# Altium schematic sheet ESP32-TEC.SchDoc
size A3
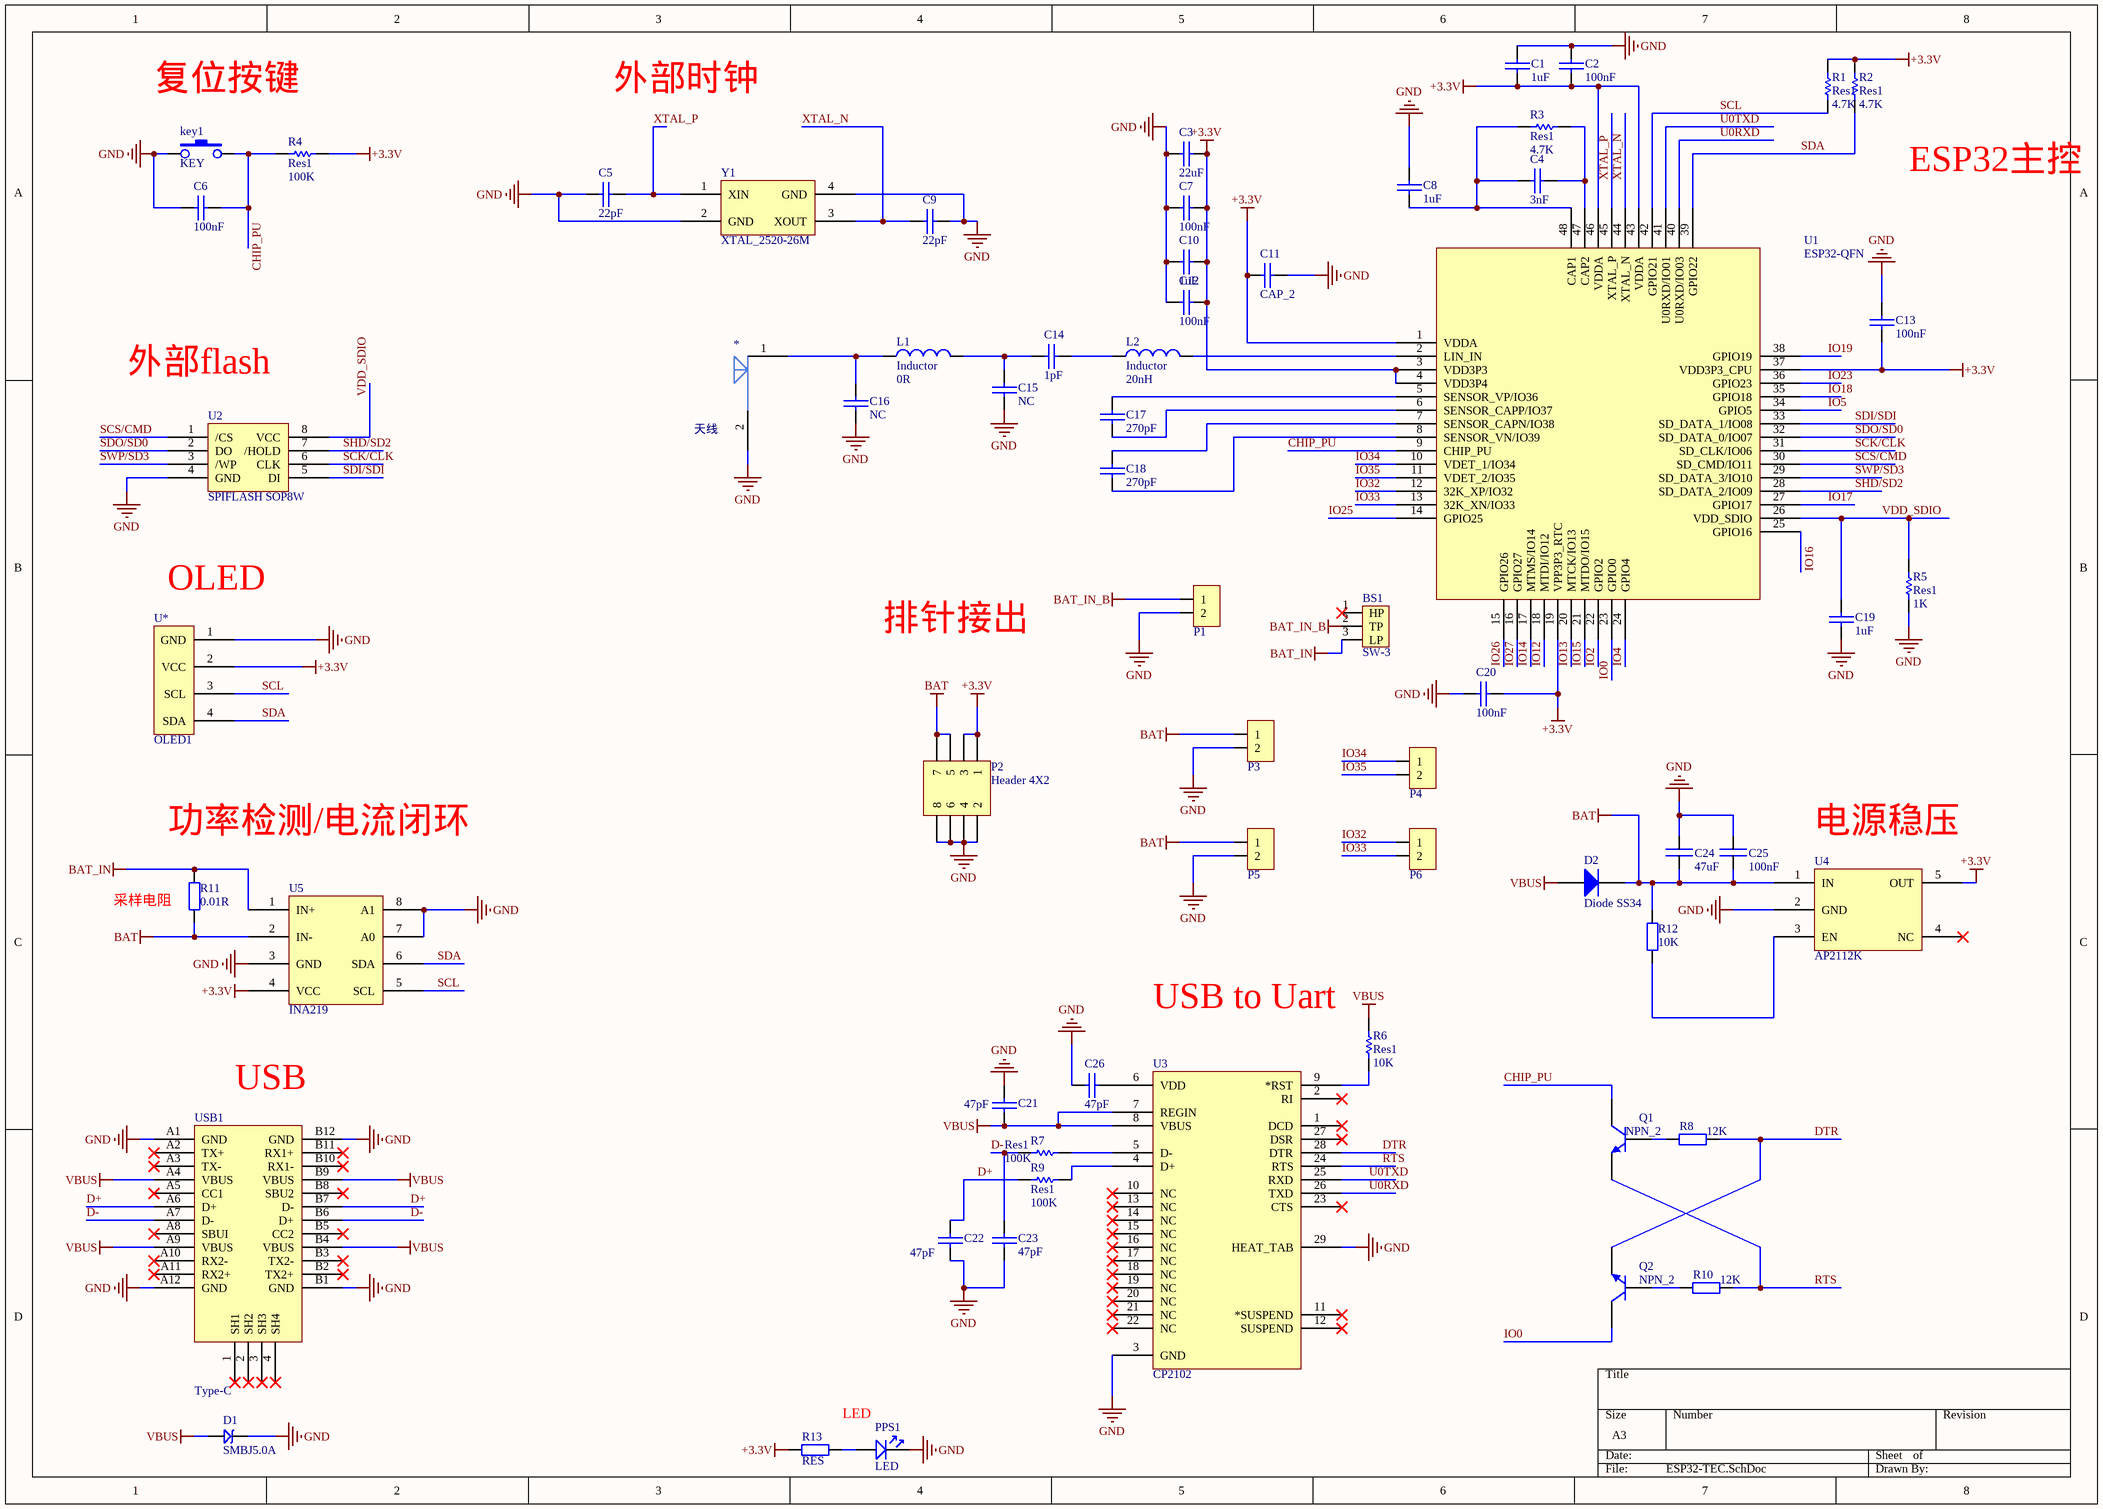
[diagram p0: ESP32-TEC.SchDoc]

## Parts
*  天线  [WIFI-ANT]
BS1  SW-3  [纽子开关]
C1  1uF  [0603-C]
C2  100nF  [0603-C]
C3  22uF  [0603-C]
C4  3nF  [0603-C]
C5  22pF  [0603-C]
C6  100nF  [0603-C]
C7  100nF  [0603-C]
C8  1uF  [0603-C]
C9  22pF  [0603-C]
C10  1uF  [0603-C]
C11  CAP_2  [0603-C]
C12  100nF  [0603-C]
C13  100nF  [0603-C]
C14  1pF  [0603-C]
C15  NC  [0603-C]
C16  NC  [0603-C]
C17  270pF  [0603-C]
C18  270pF  [0603-C]
C19  1uF  [0603-C]
C20  100nF  [0603-C]
C21  47pF  [0603-C]
C22  47pF  [0603-C]
C23  47pF  [0603-C]
C24  47uF  [0603-C]
C25  100nF  [0603-C]
C26  47pF  [0603-C]
D1  SMBJ5.0A  [0603-C]
D2  Diode SS34  [DIODE-SMA]
key1  KEY  [侧帖按键]
L1  Inductor  value 0R  [0603AR]
L2  Inductor  value 20nH  [0805_L]
P1  HDR1X2_180_2.54  [XT-30]  (value not drawn)
P2  Header 4X2  [HDR2X4]
P3  HDR1X2_180_2.54  [XT-30]  (value not drawn)
P4  HDR1X2_180_2.54  [XT-30]  (value not drawn)
P5  HDR1X2_180_2.54  [XT-30]  (value not drawn)
P6  HDR1X2_180_2.54  [XT-30]  (value not drawn)
PPS1  LED  [0603-C]
Q1  NPN_2  [SOT-23R - duplicate2]
Q2  NPN_2  [SOT-23R - duplicate2]
R1  Res1  value 4.7K  [0603-R]
R2  Res1  value 4.7K  [0603-R]
R3  Res1  value 4.7K  [0603-R]
R4  Res1  value 100K  [0603-R]
R5  Res1  value 1K  [0603-R]
R6  Res1  value 10K  [0603-R]
R7  Res1  value 100K  [0603-R]
R8  12K  [0603-R]
R9  Res1  value 100K  [0603-R]
R10  12K  [0603-R]
R11  0.01R  [1206]
R12  10K  [0603-R]
R13  RES  [0603P]
U1  ESP32-QFN  [QFN48-6x6]
U2  SPIFLASH SOP8W  [SOP-8]
U3  CP2102  [QFN28]
U4  AP2112K  [LC-SOT-23-5]
U5  INA219  [LC-SOT-23-8]
U*  OLED1  [HDR1X4]
USB1  Type-C  [Type-c]
Y1  XTAL_2520-26M  [2520无源]

## Nets
+3.3V: C1.2 C2.2 C3.2 C7.2 C10.2 C11.1 C12.2 C13.2 C20.1 P2.1 P2.3 R1.2 R2.2 R4.2 R13.1 U1.1(VDDA) U1.3(VDD3P3) U1.4(VDD3P4) U1.19(VPP3P3_RTC) U1.37(VDD3P3_CPU) U1.43(VDDA) U1.46(VDDA) U4.5(OUT) U5.4(VCC) U*.2(VCC)
BAT: C24.2 C25.2 D2.2(K) P2.5 P2.7 P3.1 P5.1 R11.1 R12.2 U4.1(IN) U5.2(IN-)
BAT_IN: BS1.3(LP) R11.2 U5.1(IN+)
BAT_IN_B: BS1.2(TP) P1.1
GND: *.2 C1.1 C2.1 C3.1 C5.2 C6.2 C7.1 C8.1 C9.1 C10.1 C11.2 C12.1 C13.1 C15.1 C16.1 C19.2 C20.2 C21.2 C22.1 C23.2 C24.1 C25.1 C26.2 D1.2 key1.1 P1.2 P2.2 P2.4 P2.6 P2.8 P3.2 P5.2 PPS1.2 R5.1 U2.4(GND) U3.3(GND) U3.29(HEAT_TAB) U4.2(GND) U5.3(GND) U5.7(A0) U5.8(A1) U*.1(GND) USB1.A1(GND) USB1.A12(GND) USB1.B1(GND) USB1.B12(GND) Y1.2(GND) Y1.4(GND)
VBUS: C21.1 D1.1 D2.1(A) R6.2 U3.7(REGIN) U3.8(VBUS) USB1.A4(VBUS) USB1.A9(VBUS) USB1.B4(VBUS) USB1.B9(VBUS)
CHIP_PU: C6.1 key1.2 Q1.3(C) R4.1 U1.9(CHIP_PU)
D+: C22.2 R9.1 USB1.A6(D+) USB1.B7(D-)
D-: C23.1 R7.1 USB1.A7(D-) USB1.B6(D+)
DTR: Q2.1(E) R8.2 U3.28(DTR)
IO0: Q2.3(C) U1.23(GPIO0)
IO2: U1.22(GPIO2)
IO4: U1.24(GPIO4)
IO5: U1.34(GPIO5)
IO12: U1.18(MTDI/IO12)
IO13: U1.20(MTCK/IO13)
IO14: U1.17(MTMS/IO14)
IO15: U1.21(MTDO/IO15)
IO16: U1.25(GPIO16)
IO17: U1.27(GPIO17)
IO18: U1.35(GPIO18)
IO19: U1.38(GPIO19)
IO23: U1.36(GPIO23)
IO25: U1.14(GPIO25)
IO26: U1.15(GPIO26)
IO27: U1.16(GPIO27)
IO32: P6.1 U1.12(32K_XP/IO32)
IO33: P6.2 U1.13(32K_XN/IO33)
IO34: P4.1 U1.10(VDET_1/IO34)
IO35: P4.2 U1.11(VDET_2/IO35)
RTS: Q1.1(E) R10.2 U3.24(RTS)
SCK/CLK: U1.31(SD_CLK/IO06) U2.6(CLK)
SCL: R1.1 U1.42(GPIO21) U5.5(SCL) U*.3(SCL)
SCS/CMD: U1.30(SD_CMD/IO11) U2.1(/CS)
SDA: R2.1 U1.39(GPIO22) U5.6(SDA) U*.4(SDA)
SDI/SDI: U1.33(SD_DATA_1/IO08) U2.5(DI)
SDO/SD0: U1.32(SD_DATA_0/IO07) U2.2(DO)
SHD/SD2: U1.28(SD_DATA_2/IO09) U2.7(/HOLD)
SWP/SD3: U1.29(SD_DATA_3/IO10) U2.3(/WP)
U0RXD: U1.40(U0RXD/IO03) U3.26(TXD)
U0TXD: U1.41(U0RXD/IO01) U3.25(RXD)
VDD_SDIO: C19.1 R5.2 U1.26(VDD_SDIO) U2.8(VCC)
XTAL_N: C9.2 U1.44(XTAL_N) Y1.3(XOUT)
XTAL_P: C5.1 U1.45(XTAL_P) Y1.1(XIN)
Net*_1: *.1 C16.2 L1.1
NetC4_1: C4.1 C8.2 R3.2 U1.48(CAP1)
NetC4_2: C4.2 R3.1 U1.47(CAP2)
NetC14_1: C14.1 C15.2 L1.2
NetC14_2: C14.2 L2.1
NetC17_1: C17.1 U1.6(SENSOR_CAPP/IO37)
NetC17_2: C17.2 U1.5(SENSOR_VP/IO36)
NetC18_1: C18.1 U1.8(SENSOR_VN/IO39)
NetC18_2: C18.2 U1.7(SENSOR_CAPN/IO38)
NetC26_1: C26.1 U3.6(VDD)
NetL2_2: L2.2 U1.2(LIN_IN)
NetPPS1_1: PPS1.1 R13.2
NetQ1_2: Q1.2(B) R8.1
NetQ2_2: Q2.2(B) R10.1
NetR6_1: R6.1 U3.9(*RST)
NetR7_2: R7.2 U3.5(D-)
NetR9_2: R9.2 U3.4(D+)
NetR12_1: R12.1 U4.3(EN)

Not connected (* = marked no-connect by the designer): BS1 1(HP)*; U3 1(DCD)* 2(RI)* 10(NC)* 11(*SUSPEND)* 12(SUSPEND)* 13(NC)* 14(NC)* 15(NC)* 16(NC)* 17(NC)* 18(NC)* 19(NC)* 20(NC)* 21(NC)* 22(NC)* 23(CTS)* 27(DSR)*; U4 4(NC)*; USB1 1(SH1)* 2(SH2)* 3(SH3)* 4(SH4)* A2(TX+)* A3(TX-)* A5(CC1)* A8(SBUI)* A10(RX2-)* A11(RX2+)* B2(TX2+)* B3(TX2-)* B5(CC2)* B8(SBU2)* B10(RX1-)* B11(RX1+)*

## Notes on the sheet
- 复位按键
- 外部时钟
- ESP32主控
- 外部flash
- (near U*) OLED
- 排针接出
- (near R11) 功率检测/电流闭环
- (near U4) 电源稳压
- (near R11) 采样电阻
- (near R6) USB to Uart
- (near USB1) USB
- LED

## Library data of the parts
BS1 = SW
C1-C10 C12-C23 C26 = CAP_2
C24 C25 = C1_6
D1 = SMBJ: TVS
D2 = Diode 1N4001: 1 Amp General Purpose Rectifier; Published: 8-Jun-2000; LatestRevisionDate: 17-Jul-2002; LatestRevisionNote: Re-released for DXP Platform.; DatasheetVersion: 1998; PackageVersion: Aug-1999; PackageReference: DO-41; Publisher: Altium Limited; PackageDescription: Diode, Axial; Body 5.2 x 2.7 mm (LxDia. max), Lead Dia. 0.86 mm (max); Code_JEDEC: DO-204-AL; ComponentLink1Description: Manufacturer Link; ComponentLink1URL: http://www.fairchildsemi.com/; ComponentLink2Description: Datasheet; ComponentLink2URL: http://www.fairchildsemi.com/ds/1N%2F1N4001.pdf
L1 L2 = Inductor: Code_IEC: 1005; Published: 8-Jun-2000; LatestRevisionDate: 17-Jul-2002; LatestRevisionNote: Re-released for DXP Platform.; PackageReference: 0402-A; Publisher: Altium Limited; Code_JEITA: 0402
P1 P3-P6 = HDR1X2_180_2.54: Header
P2 = Header 4X2: Header, 4-Pin, Dual row; LatestRevisionDate: 17-Jul-2002; LatestRevisionNote: Re-released for DXP Platform.; Publisher: Altium Limited
Q1 Q2 = NPN_2: NPN Bipolar Transistor; Published: 8-Jun-2000; LatestRevisionDate: 17-Jul-2002; LatestRevisionNote: Re-released for DXP Platform.; PackageReference: TO-226-AA; Publisher: Altium Limited; PackageDescription: TO, Flat Index; 3 In-Line, Axial Leads; Body Dia. 4.8mm; Leads 0.55 x 0.51 mm (max); Code_JEDEC: TO-226-AA
R1-R7 R9 = Res1: Resistor; Published: 8-Jun-2000; LatestRevisionDate: 17-Jul-2002; LatestRevisionNote: Re-released for DXP Platform.; PackageReference: AXIAL-0.3; Publisher: Altium Limited; PackageDescription: Axial Device, Thru-Hole; 2 Leads; 0.3 in Pin Spacing
R8 R10-R13 = RES: Resistor; Published: 8-Jun-2000; LatestRevisionDate: 17-Jul-2002; LatestRevisionNote: Re-released for DXP Platform.; PackageReference: AXIAL-0.4; Publisher: Altium Limited; PackageDescription: Axial Device, Thru-Hole; 2 Leads; 0.4 in Pin Spacing
U5 = INA219: SOT-8